# Altium schematic sheet BlockDiagram.SchDoc
size B
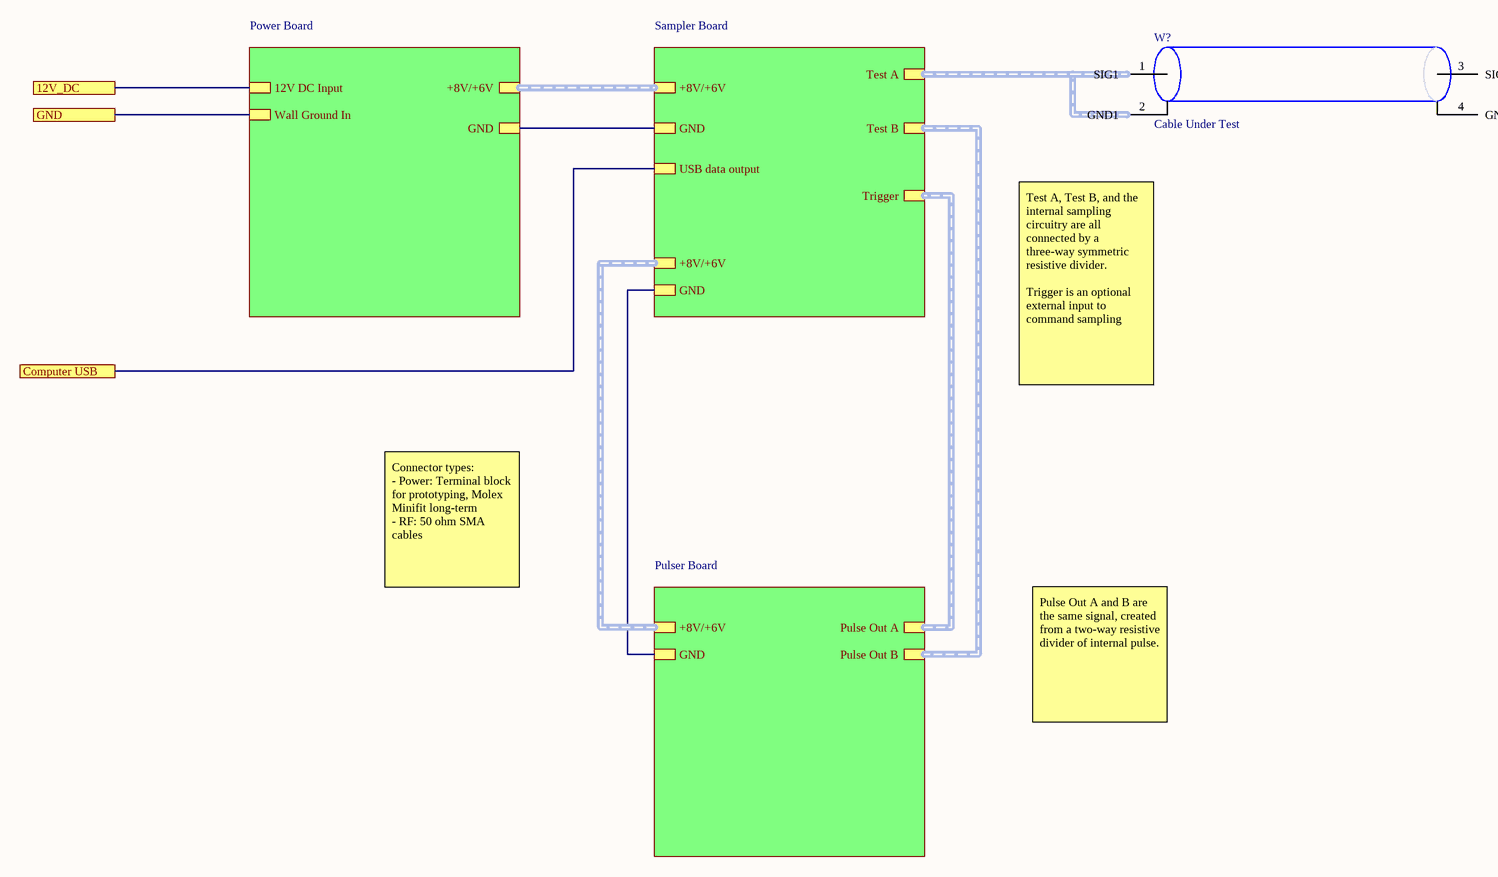
[diagram p0: BlockDiagram.SchDoc]

## Parts
W?  Cable Under Test

## Sub-sheets
Power Board = File Name: 12V DC Input, Wall Ground In, +8V/+6V, GND
Pulser Board = File Name: GND, +8V/+6V, Pulse Out A, Pulse Out B
Sampler Board = File Name: GND, +8V/+6V, GND, +8V/+6V, Test A, USB data output, Trigger, Test B

## Ports
12V_DC, Computer USB, GND

## Nets
12V_DC: port 12V_DC, sheet Power Board/12V DC Input
Computer USB: port Computer USB, sheet Sampler Board/USB data output
GND: port GND, sheet Power Board/Wall Ground In
(unnamed): sheet Power Board/GND, sheet Sampler Board/GND
(unnamed): sheet Pulser Board/GND, sheet Sampler Board/GND

Not connected (* = marked no-connect by the designer): W? 1(SIG1) 2(GND1) 3(SIG2) 4(GND2)

## Buses and harness runs
harness sheet Power Board/+8V/+6V = sheet Sampler Board/+8V/+6V
harness sheet Pulser Board/+8V/+6V = sheet Sampler Board/+8V/+6V
harness sheet Pulser Board/Pulse Out A = sheet Sampler Board/Trigger
harness sheet Pulser Board/Pulse Out B = sheet Sampler Board/Test B

## Notes on the sheet
- Test A, Test B, and the internal sampling circuitry are all connected by a three-way symmetric resistive divider.
  Trigger is an optional external input to command sampling
- Connector types:
  - Power: Terminal block for prototyping, Molex Minifit long-term
  - RF: 50 ohm SMA cables
- Pulse Out A and B are the same signal, created from a two-way resistive divider of internal pulse.

## Library data of the parts
W? = Transmission Line: Transmission Line symbol